# Altium schematic sheet CLOCK.SchDoc
size A4
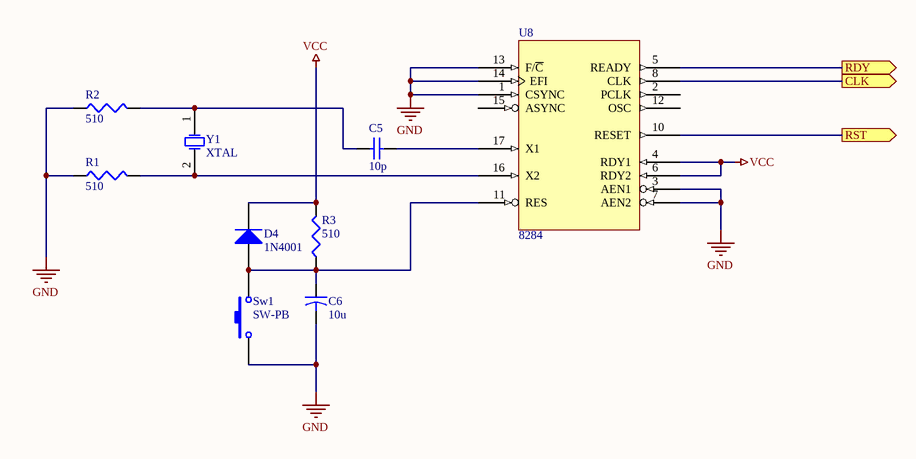
[diagram p0: CLOCK.SchDoc]

## Parts
C5  value 10p  [RAD-0.3]  (hidden comment: Cap)
C6  value 10u  [CAPR5-4X5]  (hidden comment: Cap2)
D4  1N4001  [DO-41]
R1  value 510  [J1-0603]  (hidden comment: Res3)
R2  value 510  [J1-0603]  (hidden comment: Res3)
R3  value 510  [J1-0603]  (hidden comment: Res3)
Sw1  SW-PB  [SPST-2]
U8  8284  [DIP18]
Y1  XTAL  [R38]

## Ports
CLK (out), RDY (out), RST (out)

## Nets
GND: C6.2 R1.1 R2.1 Sw1.1 U8.1(CSYNC) U8.3(AEN1) U8.7(AEN2) U8.9(GND) U8.13(F/~{C}) U8.14(EFI)
VCC: D4.2(K) R3.2 U8.4(RDY1) U8.6(RDY2) U8.18(VCC)
CLK: U8.8(CLK) ; port CLK
RDY: U8.5(READY) ; port RDY
RST: U8.10(RESET) ; port RST
NetC5_1: C5.1 R2.2 Y1.1(OSC1)
NetC5_2: C5.2 U8.17(X1)
NetC6_1: C6.1 D4.1(A) R3.1 Sw1.2 U8.11(RES)
NetR1_2: R1.2 U8.16(X2) Y1.2(OSC2)

Not connected (* = marked no-connect by the designer): U8 2(PCLK) 12(OSC) 15(ASYNC)

## Library data of the parts
C5 = Cap: Capacitor; Published: 8-Jun-2000; LatestRevisionDate: 17-Jul-2002; LatestRevisionNote: Re-released for DXP Platform.; PackageReference: RAD-0.3; Publisher: Altium Limited
C6 = Cap2: Capacitor; Published: 23-Sep-2002; PackageReference: CAPR5-4X5; Publisher: Altium Limited
D4 = Diode 1N4001: 1 Amp General Purpose Rectifier; Published: 8-Jun-2000; LatestRevisionDate: 17-Jul-2002; LatestRevisionNote: Re-released for DXP Platform.; DatasheetDocument: 1998; PackageDocument: Aug-1999; PackageReference: DO-41; Publisher: Altium Limited; Code_JEDEC: DO-204-AL; ComponentLink1Description: Manufacturer Link; ComponentLink1URL: http://www.fairchildsemi.com/; ComponentLink2Description: Datasheet; ComponentLink2URL: http://www.fairchildsemi.com/ds/1N%2F1N4001.pdf
R1-R3 = Res3: Resistor; Published: 8-Jun-2000; LatestRevisionDate: 04-Mar-2005; LatestRevisionNote: PCB Footprint replaced.; PackageReference: J1-0603; Publisher: Altium Limited
Sw1 = SW-PB: Switch; Published: 24-Mar-1999; LatestRevisionDate: 17-Jul-2002; LatestRevisionNote: Re-released for DXP Platform.; PackageReference: SPST-2; Publisher: Altium Limited
Y1 = XTAL: Crystal Oscillator; Published: 8-Jun-2000; LatestRevisionDate: 17-Jul-2002; LatestRevisionNote: Re-released for DXP Platform.; PackageReference: R38; Publisher: Altium Limited